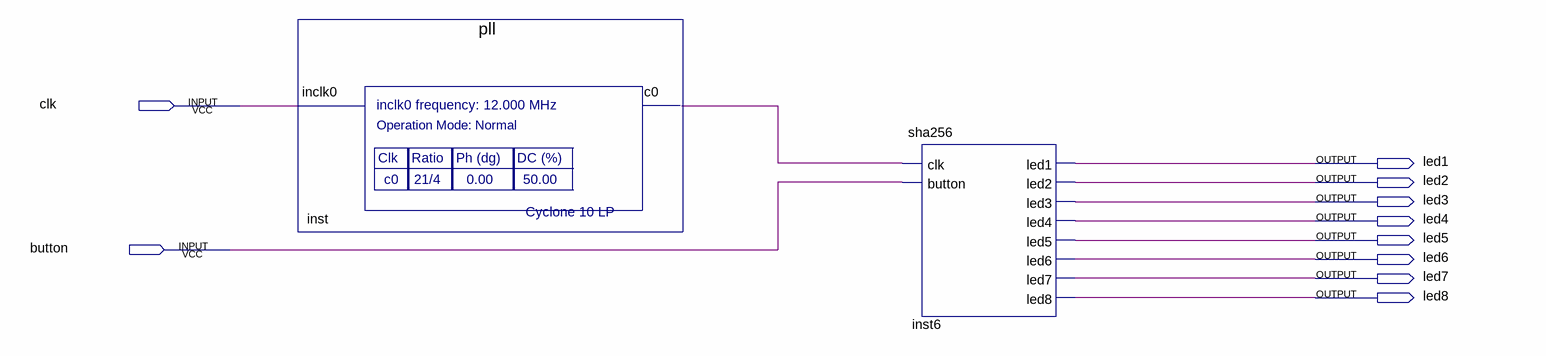
[diagram p0: schematic sheet]
// Quartus schematic top.bdf as structural Verilog: 2 symbols, 10 pins
module top (
  input  clk,
  input  button,
  output led1,
  output led2,
  output led3,
  output led4,
  output led5,
  output led6,
  output led7,
  output led8
);

  wire inst_c0;

  pll inst (.inclk0(clk), .c0(inst_c0));
  sha256 inst6 (
    .clk(inst_c0), .button(button), .led1(led1), .led2(led2), .led3(led3), .led4(led4), .led5(led5),
    .led6(led6), .led7(led7), .led8(led8));
endmodule
